# Altium schematic sheet ESP32_Watch_Project_V2.0.SchDoc
size A4
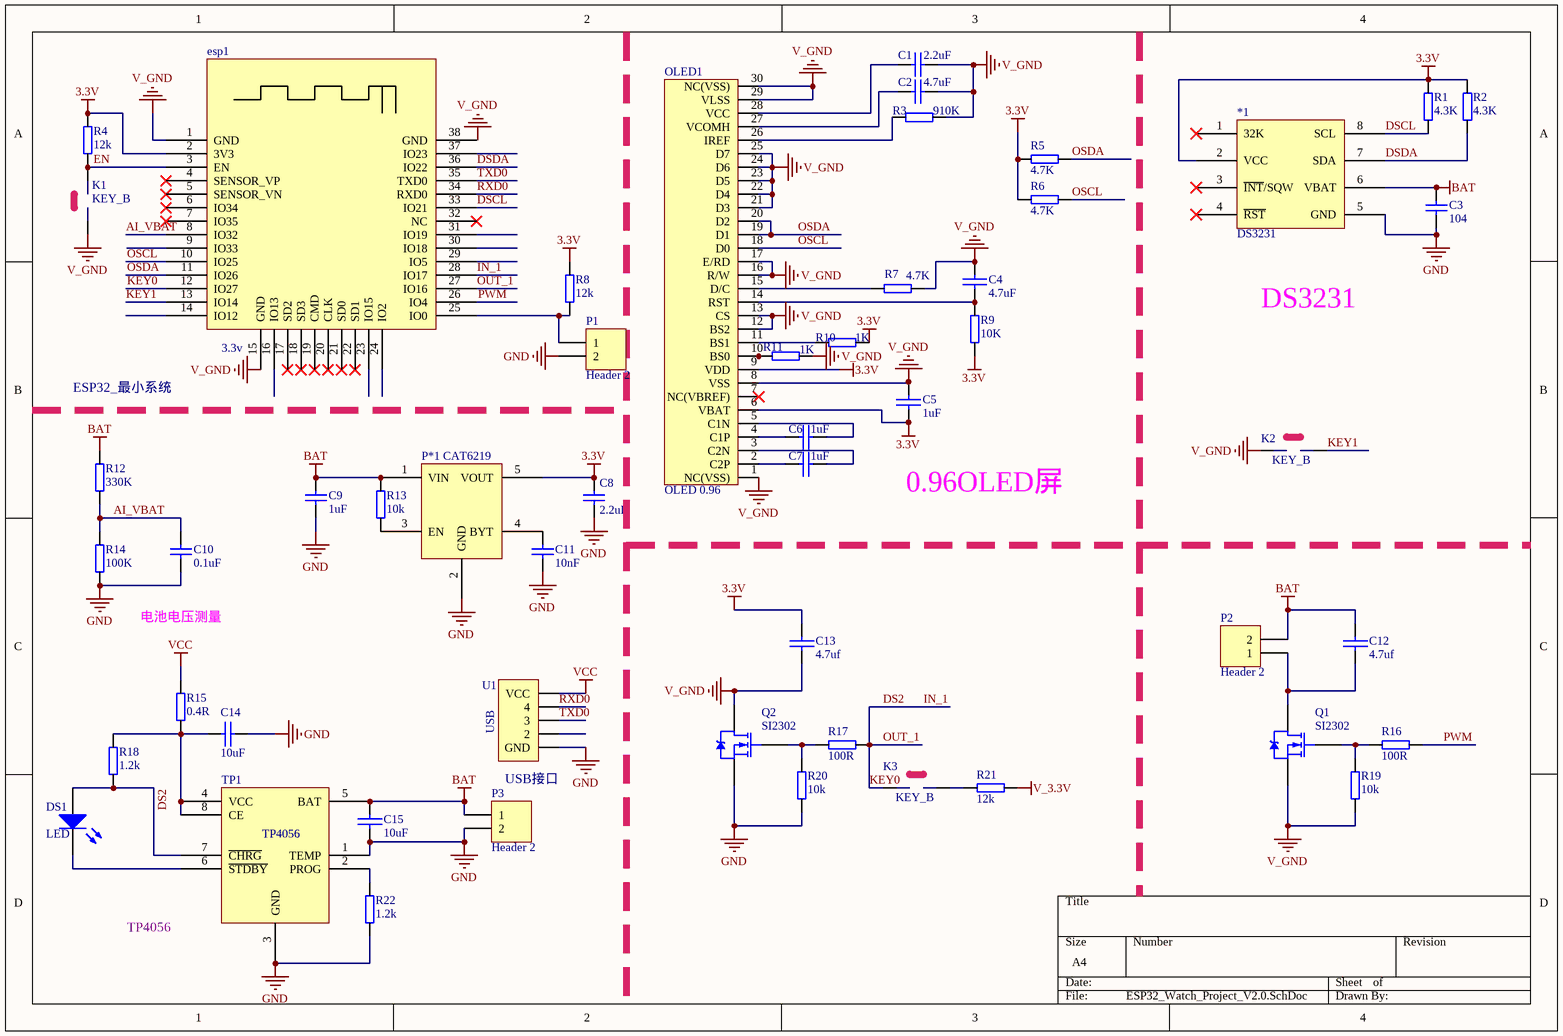
[diagram p0: ESP32_Watch_Project_V2.0.SchDoc]

## Parts
*1  DS3231  [2104]
C1  2.2uF  [R0603]
C2  4.7uF  [R0603]
C3  104  [R0603]
C4  4.7uF  [R0603]
C5  1uF  [R0603]
C6  1uF  [R0603]
C7  1uF  [R0603]
C8  2.2uF  [R0603]
C9  1uF  [R0603]
C10  0.1uF  [R0603]
C11  10nF  [R0603]
C12  4.7uf  [R0603]
C13  4.7uf  [R0603]
C14  10uF  [R0603]
C15  10uF  [R0603]
DS1  LED  [SMDLED]
esp1  3.3v  [esp32_cord]
K1  KEY_B  [KEY_b]
K2  KEY_B  [KEY_b]
K3  KEY_B  [KEY_b]
OLED1  OLED 0.96  [0.96_OLED]
P1  Header 2  [HDR1X2]
P2  Header 2  [HDR1X2]
P3  Header 2  [HDR1X2]
P*1  CAT6219  [CAT6219]
Q1  SI2302  [SOT-23(SOT-23-3)]
Q2  SI2302  [SOT-23(SOT-23-3)]
R1  4.3K  [C0603]
R2  4.3K  [C0603]
R3  910K  [C0603]
R4  12k  [C0603]
R5  4.7K  [C0603]
R6  4.7K  [C0603]
R7  4.7K  [C0603]
R8  12k  [C0603]
R9  10K  [C0603]
R10  1K  [C0603]
R11  1K  [C0603]
R12  330K  [C0603]
R13  10k  [C0603]
R14  100K  [C0603]
R15  0.4R  [C0603]
R16  100R  [C0603]
R17  100R  [C0603]
R18  1.2k  [C0603]
R19  10k  [C0603]
R20  10k  [C0603]
R21  12k  [C0603]
R22  1.2k  [C0603]
TP1  TP4056  [2104]
U1  U?  [type_a]  (value not drawn)

## Nets
3.3V: *1.2(VCC) C5.1 C8.2 C13.1 esp1.2(3V3) OLED1.6(VBAT) OLED1.9(VDD) P*1.5(VOUT) R1.1 R2.1 R4.2 R5.2 R6.2 R8.2 R9.2 R10.1
BAT: *1.6(VBAT) C3.2 C9.2 C12.1 C15.2 P2.2 P3.1 P*1.1(VIN) R12.2 R13.2 TP1.5(BAT)
GND: *1.5(GND) C3.1 C8.1 C9.1 C10.1 C11.1 C14.2 C15.1 P1.2 P3.2 P*1.2(GND) Q2.2(S) R14.1 R20.1 R22.2 TP1.1(TEMP) TP1.3(GND) U1.1(GND)
V_3.3V: R21.1
V_GND: C1.2 C2.2 C4.2 C5.2 C13.2 esp1.1(GND) esp1.15(GND) K1.1 OLED1.1(NC(VSS)) OLED1.8(VSS) OLED1.12(BS2) OLED1.13(CS) OLED1.16(R/W) OLED1.17(E/RD) OLED1.29(VLSS) OLED1.30(NC(VSS)) Q1.2(S) Q2.3(D) R3.2 R7.2 R11.1 R19.1
VCC: R15.1 U1.5(VCC)
AI_VBAT: C10.2 esp1.8(IO32) R12.1 R14.2
DS2: DS1.1(A) esp1.27(IO16) esp1.28(IO17) R17.1 R18.2 TP1.7(~{CHRG})  [also labelled IN_1, OUT_1]
DSCL: *1.8(SCL) esp1.33(IO21) R1.2
DSDA: *1.7(SDA) esp1.36(IO22) R2.2
EN: esp1.3(EN) K1.2 R4.1
KEY0: esp1.12(IO27) K3.1
KEY1: esp1.13(IO14) K2.2
OSCL: esp1.10(IO25) OLED1.18(D0) R6.1
OSDA: esp1.11(IO26) OLED1.19(D1) OLED1.20(D2) R5.1
PWM: esp1.26(IO4) R16.1
RXD0: esp1.34(RXD0) U1.4
TXD0: esp1.35(TXD0) U1.3
NetC1_1: C1.1 OLED1.28(VCC)
NetC2_1: C2.1 OLED1.27(VCOMH)
NetC4_1: C4.1 OLED1.14(RST) R9.1
NetC6_1: C6.1 OLED1.5(C1N)
NetC6_2: C6.2 OLED1.4(C1P)
NetC7_1: C7.1 OLED1.3(C2N)
NetC7_2: C7.2 OLED1.2(C2P)
NetC11_2: C11.2 P*1.4(BYT)
NetC12_2: C12.2 P2.1 Q1.3(D)
NetC14_1: C14.1 R15.2 R18.1 TP1.4(VCC) TP1.8(CE)
NetDS1_2: DS1.2(K) TP1.6(~{STDBY})
Netesp1_25: esp1.25(IO0) P1.1 R8.1
NetK3_2: K3.2 R21.2
NetOLED1_10: OLED1.10(BS0) R11.2
NetOLED1_11: OLED1.11(BS1) R10.2
NetOLED1_15: OLED1.15(D/C) R7.1
NetOLED1_21: OLED1.21(D3) OLED1.22(D4) OLED1.23(D5) OLED1.24(D6) OLED1.25(D7)
NetOLED1_26: OLED1.26(IREF) R3.1
NetP*1_3: P*1.3(EN) R13.1
NetQ1_1: Q1.1(G) R16.2 R19.2
NetQ2_1: Q2.1(G) R17.2 R20.2
NetR22_1: R22.1 TP1.2(PROG)

Not connected (* = marked no-connect by the designer): *1 1(32K)* 3(~{INT}/SQW)* 4(~{RST})*; esp1 4(SENSOR_VP)* 5(SENSOR_VN)* 6(IO34)* 7(IO35)* 9(IO33) 14(IO12) 16(IO13) 17(SD2)* 18(SD3)* 19(CMD)* 20(CLK)* 21(SD0)* 22(SD1)* 23(IO15) 24(IO2) 29(IO5) 30(IO18) 31(IO19) 32(NC)* 37(IO23) 38(GND); K2 1; OLED1 7(NC(VBREF))*; U1 2

## Notes on the sheet
- DS3231
- ESP32_最小系统
- 0.96OLED屏
- 电池电压测量
- USB接口
- TP4056
- Labels drawn without touching a wire or pin: V_GND
- (in symbol type_a) USB

## Library data of the parts
C1 C2 C4-C7 C12-C15 = CAP: Capacitor
C3 C8-C11 = Cap_1: Capacitor; Value: 0.01uF; Published: 8-Jun-2000; LatestRevisionDate: 17-Jul-2002; LatestRevisionNote: Re-released for DXP Platform.; PackageReference: RAD-0.3; Publisher: Altium Limited; PackageDescription: Radial Cap, Thru-Hole; 2 Leads; 0.3 in Pin Spacing
DS1 = LED2: Typical RED, GREEN, YELLOW, AMBER GaAs LED; Published: 8-Jun-2000; LatestRevisionDate: 17-Jul-2002; LatestRevisionNote: Re-released for DXP Platform.; PackageDocument: Feb-2002; PackageReference: 3.2X1.6X1.1; Publisher: Altium Limited
esp1 = esp32_core
OLED1 = OLED
P1-P3 = Header 2: Header, 2-Pin; LatestRevisionDate: 17-Jul-2002; LatestRevisionNote: Re-released for DXP Platform.; Publisher: Altium Limited
Q1 Q2 = SI2302: N-Channel Power MOSFET; Published: 8-August-2017; PackageReference: SOT23-3; Publisher: mazhongwei
R1-R22 = Res
U1 = type_a